# Altium schematic sheet RcMPPT-BMS-AFE1.SchDoc: RcMPPT-BMS-AFE-1
size A4; Author: Thomas Hofmann; CompanyName: HTL St. Pölten; Organization: Altium Limited; Address1: RcMPPT; Address2: Frenchs Forest; Address3: NSW; Address4: Australia 2086; DocumentNumber: 2; Revision: 2.0; SheetNumber: 2; SheetTotal: 5
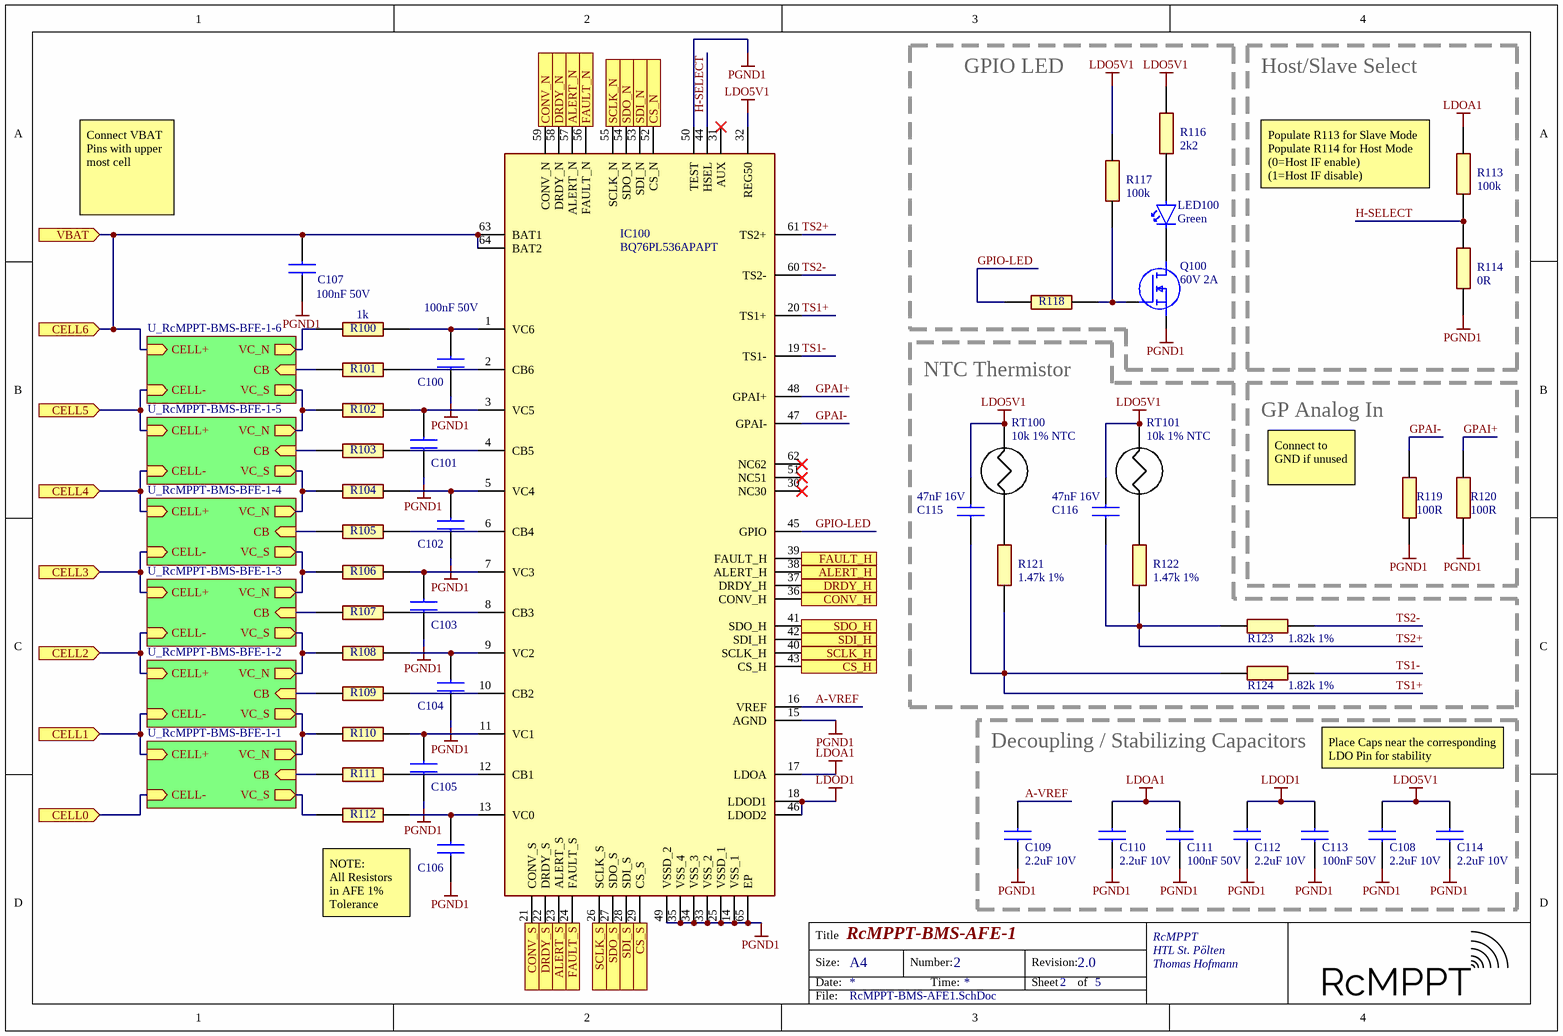
[diagram p0: RcMPPT-BMS-AFE1.SchDoc]

## Parts
C100  100nF 50V  [CAPC1608X97N]
C101  100nF 50V  [CAPC1608X97N]  (value not drawn)
C102  100nF 50V  [CAPC1608X97N]  (value not drawn)
C103  100nF 50V  [CAPC1608X97N]  (value not drawn)
C104  100nF 50V  [CAPC1608X97N]  (value not drawn)
C105  100nF 50V  [CAPC1608X97N]  (value not drawn)
C106  100nF 50V  [CAPC1608X97N]  (value not drawn)
C107  100nF 50V  [CAPC1608X97N]
C108  2.2uF 10V  [CAPC1608X97N]
C109  2.2uF 10V  [CAPC1608X97N]
C110  2.2uF 10V  [CAPC1608X97N]
C111  100nF 50V  [CAPC1608X97N]
C112  2.2uF 10V  [CAPC1608X97N]
C113  100nF 50V  [CAPC1608X97N]
C114  2.2uF 10V  [CAPC1608X97N]
C115  47nF 16V  [CAPC1608X97N]
C116  47nF 16V  [CAPC1608X97N]
IC100  BQ76PL536APAPT  [QFP50P1200X1200X120-65N]
LED100  Green  [CHIPLED_0603]
Q100  60V 2A  [SOT96P240X110-3N]
R100  1k  [RESC1005X40N]
R101  1k  [RESC1005X40N]  (value not drawn)
R102  1k  [RESC1005X40N]  (value not drawn)
R103  1k  [RESC1005X40N]  (value not drawn)
R104  1k  [RESC1005X40N]  (value not drawn)
R105  1k  [RESC1005X40N]  (value not drawn)
R106  1k  [RESC1005X40N]  (value not drawn)
R107  1k  [RESC1005X40N]  (value not drawn)
R108  1k  [RESC1005X40N]  (value not drawn)
R109  1k  [RESC1005X40N]  (value not drawn)
R110  1k  [RESC1005X40N]  (value not drawn)
R111  1k  [RESC1005X40N]  (value not drawn)
R112  1k  [RESC1005X40N]  (value not drawn)
R113  100k  [RESC1005X40N]
R114  0R  [RESC1005X40N]
R116  2k2  [RESC1005X40N]
R117  100k  [RESC1005X40N]
R118  100R  [RESC1005X40N]  (value not drawn)
R119  100R  [RESC1005X40N]
R120  100R  [RESC1005X40N]
R121  1.47k 1%  [RESC1608X50N]
R122  1.47k 1%  [RESC1608X50N]
R123  1.82k 1%  [RESC1608X50N]
R124  1.82k 1%  [RESC1608X50N]
RT100  10k 1% NTC  [THRMC1608X90N]
RT101  10k 1% NTC  [THRMC1608X90N]

## Blocks framed on the sheet
GPIO LED: LED100 Q100 R116-R118
Host/Slave Select: R113 R114
NTC Thermistor: C115 C116 R121-R124 RT100 RT101
GP Analog In: R119 R120
Decoupling / Stabilizing Capacitors: C108-C114

## Sub-sheets
U_RcMPPT-BMS-BFE-1-1 = RcMPPT-BMS-BFE.SchDoc: CB (in), VC_S (out), CELL+ (in), CELL- (in), VC_N (out)
U_RcMPPT-BMS-BFE-1-2 = RcMPPT-BMS-BFE.SchDoc: CB (in), VC_S (out), CELL+ (in), CELL- (in), VC_N (out)
U_RcMPPT-BMS-BFE-1-3 = RcMPPT-BMS-BFE.SchDoc: CB (in), VC_S (out), CELL+ (in), CELL- (in), VC_N (out)
U_RcMPPT-BMS-BFE-1-4 = RcMPPT-BMS-BFE.SchDoc: CB (in), VC_S (out), CELL+ (in), CELL- (in), VC_N (out)
U_RcMPPT-BMS-BFE-1-5 = RcMPPT-BMS-BFE.SchDoc: CB (in), VC_S (out), CELL+ (in), CELL- (in), VC_N (out)
U_RcMPPT-BMS-BFE-1-6 = RcMPPT-BMS-BFE.SchDoc: CB (in), VC_S (out), CELL+ (in), CELL- (in), VC_N (out)

## Ports
ALERT_H (out), ALERT_N (out), ALERT_S (in), CELL0 (in), CELL1 (in), CELL2 (in), CELL3 (in), CELL4 (in), CELL5 (in), CELL6 (in), CONV_H (in), CONV_N (out), CONV_S (in), CS_H (in), CS_N (out), CS_S (in), DRDY_H (out), DRDY_N (out), DRDY_S (in), FAULT_H (out), FAULT_N (out), FAULT_S (in), SCLK_H (in), SCLK_N (out), SCLK_S (in), SDI_H (in), SDI_N (out), SDI_S (in), SDO_H (out), SDO_N (out), SDO_S (in), VBAT (in)

## Nets
LDO5V1: C108.2 C114.2 C115.2 C116.2 IC100.32(REG50) R116.2 R117.2 RT100.2 RT101.2
LDOA1: C110.2 C111.2 IC100.17(LDOA) R113.2
LDOD1: C112.2 C113.2 IC100.18(LDOD1) IC100.46(LDOD2)
PGND1: C100.1 C101.1 C102.1 C103.1 C104.1 C105.1 C106.1 C107.1 C108.1 C109.1 C110.1 C111.1 C112.1 C113.1 C114.1 IC100.14(VSS_1) IC100.15(AGND) IC100.25(VSSD_1) IC100.33(VSS_2) IC100.34(VSS_3) IC100.35(VSS_4) IC100.49(VSSD_2) IC100.50(TEST) IC100.65(EP) Q100.2(S) R114.2 R119.2 R120.2
A-VREF: C109.2 IC100.16(VREF)
ALERT_H: IC100.38(ALERT_H) ; port ALERT_H
ALERT_N: IC100.57(ALERT_N) ; port ALERT_N
ALERT_S: IC100.23(ALERT_S) ; port ALERT_S
CELL0: port CELL0, sheet U_RcMPPT-BMS-BFE-1-1/CELL-
CELL1: port CELL1, sheet U_RcMPPT-BMS-BFE-1-1/CELL+, sheet U_RcMPPT-BMS-BFE-1-2/CELL-
CELL2: port CELL2, sheet U_RcMPPT-BMS-BFE-1-2/CELL+, sheet U_RcMPPT-BMS-BFE-1-3/CELL-
CELL3: port CELL3, sheet U_RcMPPT-BMS-BFE-1-3/CELL+, sheet U_RcMPPT-BMS-BFE-1-4/CELL-
CELL4: port CELL4, sheet U_RcMPPT-BMS-BFE-1-4/CELL+, sheet U_RcMPPT-BMS-BFE-1-5/CELL-
CELL5: port CELL5, sheet U_RcMPPT-BMS-BFE-1-5/CELL+, sheet U_RcMPPT-BMS-BFE-1-6/CELL-
CELL6: C107.2 IC100.63(BAT1) IC100.64(BAT2) ; port CELL6, port VBAT, sheet U_RcMPPT-BMS-BFE-1-6/CELL+
CONV_H: IC100.36(CONV_H) ; port CONV_H
CONV_N: IC100.59(CONV_N) ; port CONV_N
CONV_S: IC100.21(CONV_S) ; port CONV_S
CS_H: IC100.43(CS_H) ; port CS_H
CS_N: IC100.52(CS_N) ; port CS_N
CS_S: IC100.29(CS_S) ; port CS_S
DRDY_H: IC100.37(DRDY_H) ; port DRDY_H
DRDY_N: IC100.58(DRDY_N) ; port DRDY_N
DRDY_S: IC100.22(DRDY_S) ; port DRDY_S
FAULT_H: IC100.39(FAULT_H) ; port FAULT_H
FAULT_N: IC100.56(FAULT_N) ; port FAULT_N
FAULT_S: IC100.24(FAULT_S) ; port FAULT_S
GPAI+: IC100.48(GPAI+) R120.1
GPAI-: IC100.47(GPAI-) R119.1
GPIO-LED: IC100.45(GPIO) R118.2
H-SELECT: IC100.44(HSEL) R113.1 R114.1
SCLK_H: IC100.40(SCLK_H) ; port SCLK_H
SCLK_N: IC100.55(SCLK_N) ; port SCLK_N
SCLK_S: IC100.26(SCLK_S) ; port SCLK_S
SDI_H: IC100.42(SDI_H) ; port SDI_H
SDI_N: IC100.53(SDI_N) ; port SDI_N
SDI_S: IC100.28(SDI_S) ; port SDI_S
SDO_H: IC100.41(SDO_H) ; port SDO_H
SDO_N: IC100.54(SDO_N) ; port SDO_N
SDO_S: IC100.27(SDO_S) ; port SDO_S
TS1+: C115.1 IC100.20(TS1+) R121.1 R124.2
TS1-: IC100.19(TS1-) R124.1
TS2+: C116.1 IC100.61(TS2+) R122.1 R123.2
TS2-: IC100.60(TS2-) R123.1
NetC100_2: C100.2 IC100.1(VC6) R100.2
NetC101_2: C101.2 IC100.3(VC5) R102.2
NetC102_2: C102.2 IC100.5(VC4) R104.2
NetC103_2: C103.2 IC100.7(VC3) R106.2
NetC104_2: C104.2 IC100.9(VC2) R108.2
NetC105_2: C105.2 IC100.11(VC1) R110.2
NetC106_2: C106.2 IC100.13(VC0) R112.2
NetIC100_2: IC100.2(CB6) R101.2
NetIC100_4: IC100.4(CB5) R103.2
NetIC100_6: IC100.6(CB4) R105.2
NetIC100_8: IC100.8(CB3) R107.2
NetIC100_10: IC100.10(CB2) R109.2
NetIC100_12: IC100.12(CB1) R111.2
NetLED100_1: LED100.1(K) Q100.3(D)
NetLED100_2: LED100.2(A) R116.1
NetQ100_1: Q100.1(G) R117.1 R118.1
NetR100_1: R100.1 ; sheet U_RcMPPT-BMS-BFE-1-6/VC_N
NetR101_1: R101.1 ; sheet U_RcMPPT-BMS-BFE-1-6/CB
NetR102_1: R102.1 ; sheet U_RcMPPT-BMS-BFE-1-5/VC_N, sheet U_RcMPPT-BMS-BFE-1-6/VC_S
NetR103_1: R103.1 ; sheet U_RcMPPT-BMS-BFE-1-5/CB
NetR104_1: R104.1 ; sheet U_RcMPPT-BMS-BFE-1-4/VC_N, sheet U_RcMPPT-BMS-BFE-1-5/VC_S
NetR105_1: R105.1 ; sheet U_RcMPPT-BMS-BFE-1-4/CB
NetR106_1: R106.1 ; sheet U_RcMPPT-BMS-BFE-1-3/VC_N, sheet U_RcMPPT-BMS-BFE-1-4/VC_S
NetR107_1: R107.1 ; sheet U_RcMPPT-BMS-BFE-1-3/CB
NetR108_1: R108.1 ; sheet U_RcMPPT-BMS-BFE-1-2/VC_N, sheet U_RcMPPT-BMS-BFE-1-3/VC_S
NetR109_1: R109.1 ; sheet U_RcMPPT-BMS-BFE-1-2/CB
NetR110_1: R110.1 ; sheet U_RcMPPT-BMS-BFE-1-1/VC_N, sheet U_RcMPPT-BMS-BFE-1-2/VC_S
NetR111_1: R111.1 ; sheet U_RcMPPT-BMS-BFE-1-1/CB
NetR112_1: R112.1 ; sheet U_RcMPPT-BMS-BFE-1-1/VC_S
NetR121_2: R121.2 RT100.1
NetR122_2: R122.2 RT101.1

Not connected (* = marked no-connect by the designer): IC100 30(NC30)* 31(AUX)* 51(NC51)* 62(NC62)*

## Notes on the sheet
- Connect VBAT Pins with upper most cell
- (near R113) Populate R113 for Slave Mode
  Populate R114 for Host Mode
  (0=Host IF enable)
  (1=Host IF disable)
- Connect to GND if unused
- Place Caps near the corresponding LDO Pin for stability
- NOTE:
  All Resistors
  in AFE 1% Tolerance
- Title
- Size:
- Date:
- A4
- Number:
- Time:
- Revision:
- Sheet
- of
- RcMPPT
- File:

## Library data of the parts
C100-C116 = C0603: Capacitor; Height: 0.97
IC100 = BQ76PL536APAPT: Integrated Circuit; Manufacturer_Name: Texas Instruments; Datasheet Link: http://www.ti.com/lit/gpn/bq76pl536a; Height: 1.2mm; Manufacturer_Part_Number: BQ76PL536APAPT; Mouser Part Number: 595-BQ76PL536APAPT; Mouser Price/Stock: https://www.mouser.co.uk/ProductDetail/Texas-Instruments/BQ76PL536APAPT?qs=UlfnwZ2x8nT1EXA%252BD%252BEfIQ%3D%3D; Arrow Part Number: BQ76PL536APAPT; Arrow Price/Stock: https://www.arrow.com/en/products/bq76pl536apapt/texas-instruments?region=nac
LED100 = CHIPLED0603: LED; Mouser Price/Stock: https://www.mouser.at/c/optoelectronics/led-lighting/led-emitters/standard-leds-smd/?series=CHIPLED%200603&instock=y
Q100 = NMOS: MOSFET (N-Channel)
R100-R114 R116-R120 = R0402: Resistor; Height: 0.4mm
R121-R124 = R0603: Resistor; Height: 0.55mm
RT100 RT101 = ERT-J1VG103FA: Thermistor; Manufacturer_Name: Panasonic; Datasheet Link: https://componentsearchengine.com/Datasheets/1/ERT-J1VG103FA.pdf; Height: 0.9mm; Manufacturer_Part_Number: ERT-J1VG103FA; Mouser Part Number: 667-ERT-J1VG103FA; Mouser Price/Stock: https://www.mouser.co.uk/ProductDetail/Panasonic/ERT-J1VG103FA?qs=Tap6ps20mlMpYFuAQ7bHkg%3D%3D; Arrow Part Number: ERT-J1VG103FA; Arrow Price/Stock: https://www.arrow.com/en/products/ert-j1vg103fa/panasonic